# EAGLE design usb_ir (EAGLE 7.7.0)
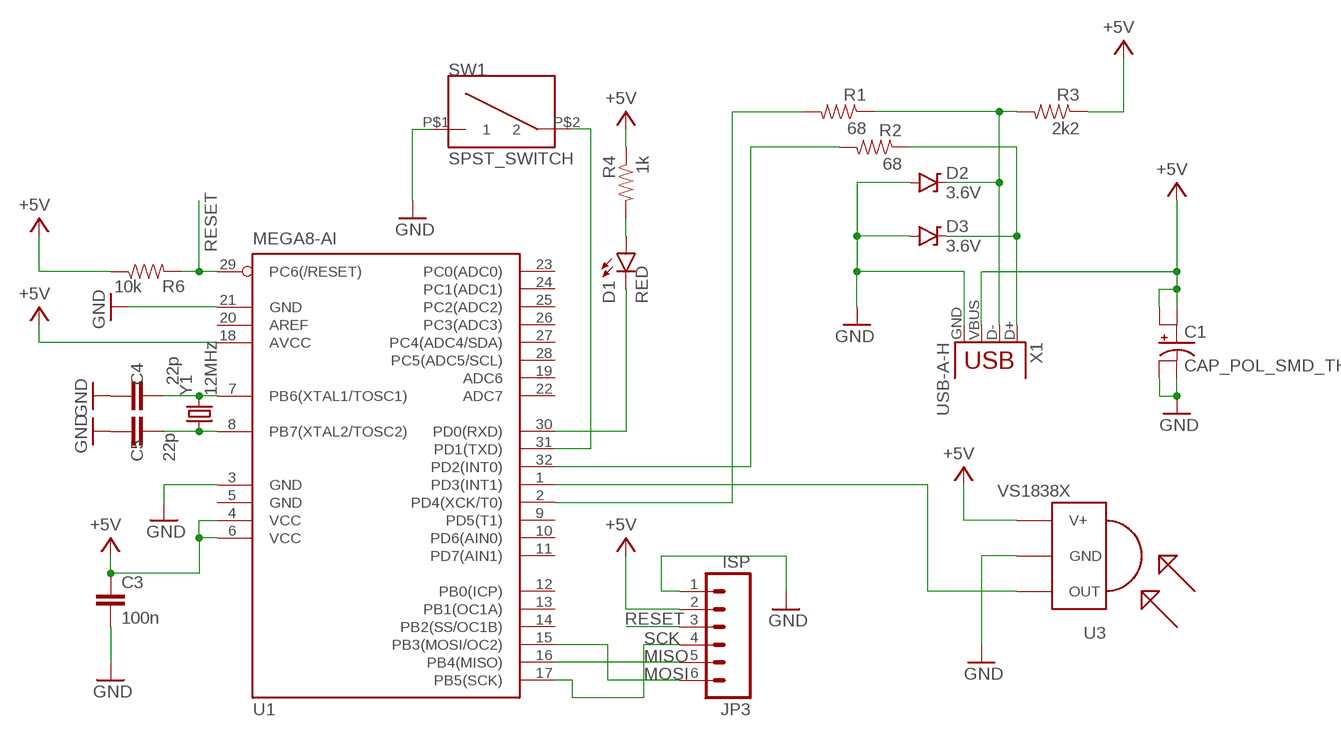
[diagram p0: schematic, sheet 1]

## Parts
C1  CAP_POL_SMD_TH  [CAP_SMD_TH_5X5]
C3  100n  CAP1206  [1206]
C4  22p  CAP1206  [1206]
C5  22p  CAP1206  [1206]
D1  RED  LED1206  [LED-1206]
D2  3.6V  DIODE-ZENERPTH  [DIODE-ZENER]
D3  3.6V  DIODE-ZENERPTH  [DIODE-ZENER]
JP3  ISP  M061X06-SMD_EDGE_FEMALE  [1X06-SMD_EDGE]
R1  68  RESISTOR1206  [1206]
R2  68  RESISTOR1206  [1206]
R3  2k2  RESISTOR1206  [1206]
R4  1k  RESISTOR1206  [1206]
R6  10k  RESISTOR1206  [1206]
SW1  SPST_SWITCH  [SMD_TACT_SWITCH]
U1  MEGA8-AI  [TQFP32-08]
U3  VS1838X  [VS1838X]
X1  USB-A-H  [USB-A-H]
Y1  12MHz  CRYSTALSMD  [HC49UP]

## Nets
+5V: C1.+ C1.+TH(+) C3.1 JP3.2 R3.1 R4.1 R6.1 U1.4(VCC) U1.6(VCC) U1.18(AVCC) U3.VCC(V+) X1.VBUS
GND: C1.- C1.-TH(-) C3.2 C4.1 C5.1 D2.P$2(A) D3.P$2(A) JP3.1 SW1.P$1 U1.3(GND) U1.21(GND) U3.GND X1.GND
MISO: JP3.5 U1.16(PB4(MISO))
MOSI: JP3.6 U1.15(PB3(MOSI/OC2))
N$1: U1.1(PD3(INT1)) U3.OUT
N$5: D2.P$1(C) R1.1 R3.2 X1.D-
N$6: D3.P$1(C) R2.1 X1.D+
N$7: R2.2 U1.32(PD2(INT0))
N$8: R1.2 U1.2(PD4(XCK/T0))
N$9: D1.C U1.30(PD0(RXD))
N$11: SW1.P$2 U1.31(PD1(TXD))
N$13: D1.A R4.2
N$22: C4.2 U1.7(PB6(XTAL1/TOSC1)) Y1.2
N$23: C5.2 U1.8(PB7(XTAL2/TOSC2)) Y1.1
RESET: JP3.3 R6.2 U1.29(PC6(/RESET))
SCK: JP3.4 U1.17(PB5(SCK))
Unconnected: U1.9(PD5(T1)) U1.10(PD6(AIN0)) U1.11(PD7(AIN1)) U1.12(PB0(ICP)) U1.13(PB1(OC1A)) U1.14(PB2(SS/OC1B)) U1.19(ADC6) U1.20(AREF) U1.22(ADC7) U1.23(PC0(ADC0)) U1.24(PC1(ADC1)) U1.25(PC2(ADC2)) U1.26(PC3(ADC3)) U1.27(PC4(ADC4/SDA)) U1.28(PC5(ADC5/SCL))

## Power pins joined to a net without a drawn wire
GND: U1.5(GND)

## Library data of the parts
C1 = Capacitors:CAP_POL_SMD_TH
C3-C5 = SparkFun-Capacitors:CAP: Capacitor Standard 0603 ceramic capacitor, and 0.1" leaded capacitor.
D1 = SparkFun-LED:LED: LEDs Standard schematic elements and footprints for 5mm, 3mm, 1206, and 0603 sized LEDs. 5mm - Spark Fun Electronics SKU : COM-00529 (and others)
D2 D3 = SparkFun-DiscreteSemi:DIODE-ZENER: Zener Diode Production Part - 8199 3.4V Zener Voltage
JP3 = SparkFun-Connectors:M06: Header 6 Standard 6-pin 0.1" header. Use with straight break away headers (SKU : PRT-00116), right angle break away headers (PRT-00553), swiss pins (PRT-00743), machine pins (PRT-00117), and female headers (PRT-00115). Molex polarized connector foot print use with SKU : PRT-08094 with associated crimp pins and housings. NOTES ON THE VARIANTS LOCK and LOCK_LONGPADS... This footprint was designed to help hold the alignment of a through-hole component (i.e. 6-pin header) while soldering it into place. You may notice that each hole has been shifted either up or down by 0.005 of an inch from it's more standard position (which is a perfectly straight line). This slight alteration caused the pins (the squares in the middle) to touch the edges of the holes. Because they are alternating, it causes a "brace" to hold the component in place. 0.005 has proven to be the perfect amount of "off-center" position when using our standard breakaway headers. Although looks a little odd when you look at the bare footprint, once you have a header in there, the alteration is very hard to notice. Also,if you push a header all the way into place, it is covered up entirely on the bottom side. This idea of altering the position of holes to aid alignment will be further integrated into the Sparkfun Library for other footprints. It can help hold any component with 3 or more connection pins.
R1-R4 R6 = SparkFun-Resistors:RESISTOR: Resistor Basic schematic elements and footprints for 0603, 1206, and PTH resistors.
SW1 = Switches:SPST_SWITCH
U1 = atmel:MEGA8: MICROCONTROLLER 8 Kbytes FLASH, 1 kbytes SRAM, 512 bytes EEPROM, USART, 6-channel 10 bit ADC, 2-channel 8 bit ADC Pin compatible with Atmega48, ATMega88, ATMega168 Source: avr.lbr; MPN: ATMEGA8-16AU; OC_FARNELL: 9171371; OC_NEWARK: 73M8863
U3 = tsop:VS1838X: VS1838 IR demodulator with supply rangeof 2.7V to 5V
X1 = SparkFun-Connectors:USB: USB Connectors USB-B-PTH is fully proven SKU : PRT-00139/CONN-08278 USB-miniB is fully proven SKU : PRT-00587 USB-A-PCB is untested. USB-A-H is throughly reviewed, but untested. Spark Fun Electronics SKU : PRT-00437 USB-B-SMT is throughly reviewed, but untested. Needs silkscreen touching up. USB-A-S has not been used/tested USB-MB-H has not been used/tested USB-MICROB has been used. CONN-09505; PROD_ID: CONN-08367
Y1 = SparkFun-FreqCtrl:CRYSTAL: Various standard crystals. Proven footprints.

## Board
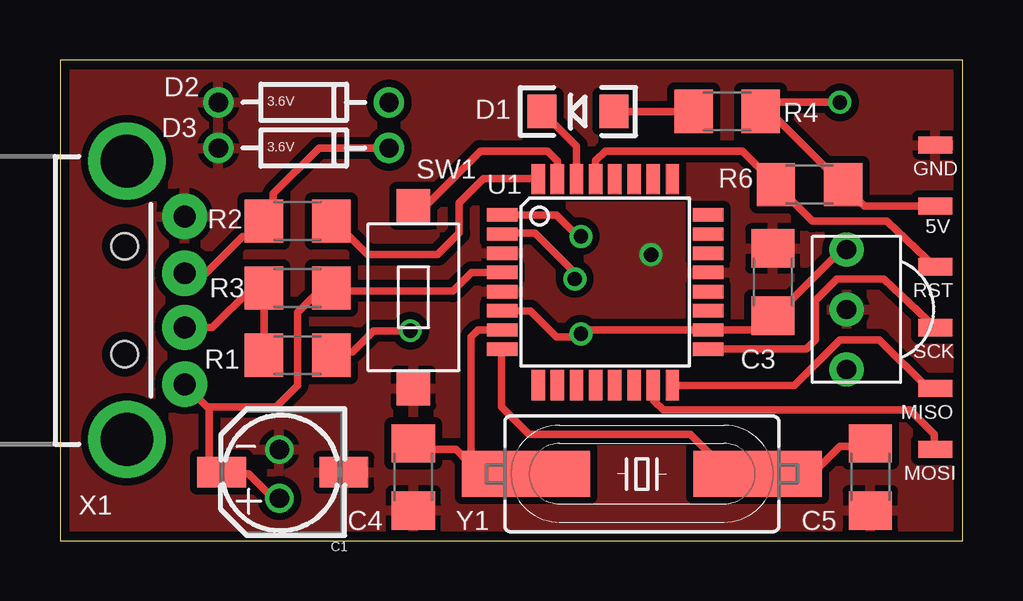
[diagram p1: board, top side]
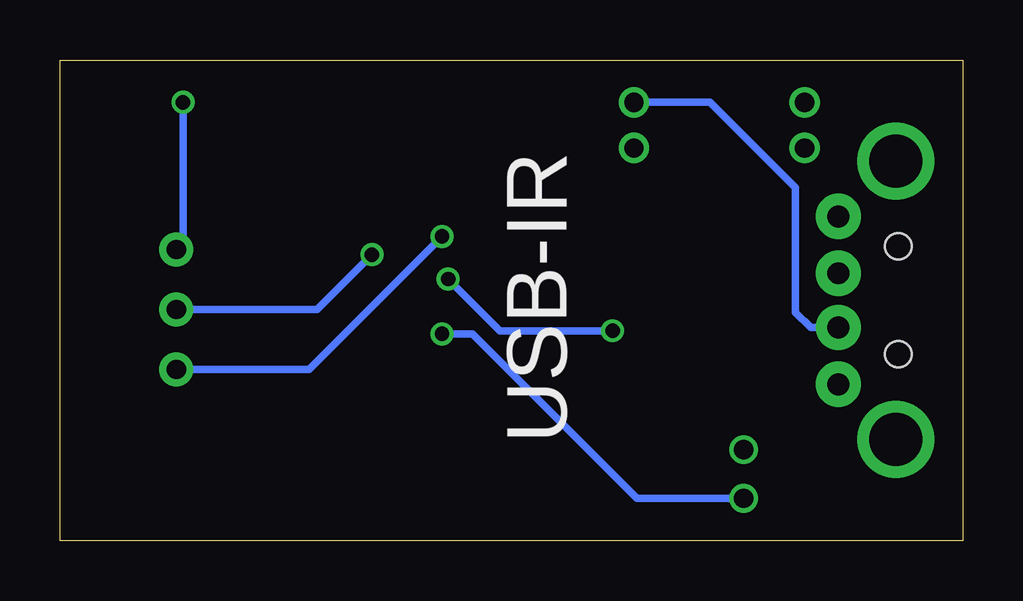
[diagram p2: board, bottom side, seen from below]

Size 37.64 x 20.06 mm. Coordinates in mm from the lower left corner, seen from the top.
Outline: 0,0 37.64,0 37.64,20.06 0,20.06 0,0
Copper layers (1*16): Top 0.0356mm / dielectric 1.5011mm / Bottom 0.0356mm
Design rules "LaenPCBOrder *": minimum track width 6mil, minimum drill 13mil, track to track 6mil, track to pad 6mil, pad to pad 6mil, via to via 6mil, smd to smd 6mil, copper to edge 15mil, drill to drill 6mil, minimum pad ring 7mil, minimum via ring 7mil, stop-mask expansion 3mil, vias tented up to drill 0mil, thermal gap 10mil

### Footprints (pad centres in the part's own frame; a part is rotated, then mirrored left to right if it is on the bottom)
CAP_SMD_TH_5X5 = smd 2.032 x 1.27: + 2.662,-0.2; - -2.435,-0.2 | drill 0.8: +TH 0.254,0.889; -TH 0.254,-1.143
1206 = smd 1.6 x 1.8: 1 -1.4,0; 2 1.4,0
LED-1206 = smd 1.2 x 1.4: A -1.5,0; C 1.5,0
DIODE-ZENER = drill 0.8 pad 1.27: P$1 -3.556,0; P$2 3.556,0
1X06-SMD_EDGE = smd 0.711 x 1.422: 1 0,-0.08; 2 2.54,-0.08; 3 5.08,-0.08; 4 7.62,-0.08; 5 10.16,-0.08; 6 12.7,-0.08
SMD_TACT_SWITCH = smd 1.397 x 1.397: P$1 -3.81,0; P$2 3.81,0
TQFP32-08 = smd 1.27 x 0.559: 1 -4.293,2.8; 2 -4.293,2; 3 -4.293,1.2; 4 -4.293,0.4; 5 -4.293,-0.4; 6 -4.293,-1.2; 7 -4.293,-2; 8 -4.293,-2.8; 17 4.293,-2.8; 18 4.293,-2; 19 4.293,-1.2; 20 4.293,-0.4; 21 4.293,0.4; 22 4.293,1.2; 23 4.293,2; 24 4.293,2.8 | smd 0.559 x 1.27: 9 -2.8,-4.293; 10 -2,-4.293; 11 -1.2,-4.293; 12 -0.4,-4.293; 13 0.4,-4.293; 14 1.2,-4.293; 15 2,-4.293; 16 2.8,-4.293; 25 2.8,4.293; 26 2,4.293; 27 1.2,4.293; 28 0.4,4.293; 29 -0.4,4.293; 30 -1.2,4.293; 31 -2,4.293; 32 -2.8,4.293
VS1838X = drill 0.8 pad 1.422: GND -0.001,0.481; OUT -2.501,0.481; VCC 2.499,0.481
USB-A-H = drill 0.914 pad 1.88: D+ 2.4,1.127; D- 2.4,-1.127; GND 2.4,3.5; VBUS 2.4,-3.5 | drill 2.2: GND2 0,-5.8; GND3 0,5.8 | hole 1.1: -0.1,2.25; -0.1,-2.25
HC49UP = smd 5.334 x 1.93: 1 -4.826,0; 2 4.826,0

### Placement (x,y rotation side)
C1  9.4,2.67 180 top
C3  29.72,10.79 90 top
C4  14.73,2.67 90 top
C5  33.78,2.67 90 top
D1  21.59,17.91 180 top
D2  10.16,18.29 180 top
D3  10.16,16.38 180 top
JP3  36.58,16.51 270 top
R1  9.91,7.75 0 top
R2  9.91,13.34 0 top
R3  9.91,10.54 180 top
R4  27.81,17.91 180 top
R6  31.24,14.86 180 top
SW1  14.73,10.16 90 top
U1  22.73,10.79 0 top
U3  33.27,9.65 90 top
X1  2.79,10.03 0 top
Y1  24.26,2.79 180 top

### Tracks (layer width: path | path; a pad name or v marks a point on that pad's centre or on a via)
+5V  (via drill 0.6)
  Top 0.305: R3.1 10.92,10.54 9.91,9.53 9.91,6.48 9.02,5.59 6.14,5.59 X1.VBUS 6.23,5.5 6.23,3.38 C1.+ 6.81,2.79 7.87,2.79 8.89,1.78 C1.+TH | R3.1 11.43,10.42 11.69,10.42 | R6.1 32.64,15.24 | 32.16,14.76 32.64,15.24 | U1.4 17.16,11.2 16.38,10.41 11.43,10.41 R3.1 | 32.64,15.24 | R6.1 29.59,17.91 R4.1 29.59,18.29 v32.51,18.29 | U1.6 19.61,9.6 20.7,8.51 21.59,8.51 v21.72,8.64 21.88,8.79 U1.18 29.12,8.79 C3.1 29.97,9.39 29.97,9.53 32.51,12.06 32.71,12.06 U3.VCC | JP3.2 33.53,13.97 R6.1
  Bottom 0.305: v21.72,8.64 20.45,8.64 13.59,1.78 C1.+TH | v32.51,18.29 32.51,12.43 U3.VCC
GND  (via drill 0.6)
  Bottom 0.305: v24.64,11.94 26.93,9.65 U3.GND
  pour Top (isolate 0.305): 0,20.19 0,0 37.59,0 37.59,20.32
MISO
  Top 0.305: U1.16 25.56,6.48 30.61,6.48 32.51,8.38 34.16,8.38 36.2,6.35 JP3.5
MOSI
  Top 0.305: U1.15 24.77,6.47 24.77,5.84 25.15,5.46 35.43,5.46 36.45,4.45 36.45,3.86 JP3.6
N$1  (via drill 0.6)
  Top 0.305: v21.72,12.7 21.59,12.7 20.7,13.59 U1.1
  Bottom 0.305: U3.OUT 27.27,7.15 v21.72,12.7
N$5
  Top 0.305: R1.1 R3.2 8,10.54 6.35,8.89 5.21,8.89 X1.D-
  Bottom 0.305: X1.D- 5.21,8.89 6.35,8.89 6.99,9.53 6.99,14.73 10.54,18.29 D2.P$1
N$6
  Top 0.305: X1.D+ 5.21,11.18 6.1,11.18 7.62,12.7 8.25,12.7 R2.1 8.89,13.72 8.89,14.47 10.79,16.38 D3.P$1
N$7
  Top 0.305: 19.78,15.24 U1.32 19.91,15.11 17.65,15.11 16.64,14.1 16.64,12.83 15.75,11.94 12.83,11.94 11.43,13.34 R2.2
N$8  (via drill 0.6)
  Top 0.305: U1.2 18.47,12.83 19.81,12.83 21.46,11.18 v21.46,10.92 | v14.61,8.76 13.08,8.76 12.19,7.87 11.43,7.87 R1.2
  Bottom 0.305: v14.61,8.76 19.3,8.76 v21.46,10.92
N$9
  Top 0.305: U1.30 21.53,16.46 D1.C
N$11
  Top 0.305: U1.31 20.73,15.84 20.32,16.26 17.53,16.26 15.37,14.1 SW1.P$2
N$13
  Top 0.305: D1.A R4.2
N$22
  Top 0.305: U1.7 17.43,8.79 17.14,8.51 17.14,3.3 | Y1.2 17.91,2.54 17.14,3.3 | 17.14,3.3 17.02,3.3 16.51,3.81 14.86,3.81 C4.2
N$23
  Top 0.305: Y1.1 27.81,2.92 26.29,4.45 19.56,4.45 18.41,5.59 18.41,7.97 U1.8 | 29.34,2.54 28.07,2.54 Y1.1 | Y1.1 31.37,2.79 32.51,3.94 33.78,3.94 C5.2
RESET
  Top 0.305: U1.29 22.33,15.86 22.73,16.26 28.45,16.26 R6.2 31.37,13.34 34.46,13.34 JP3.3
SCK
  Top 0.305: U1.17 31.11,8 31.5,8.38 31.5,10.03 32.38,10.92 34.34,10.92 JP3.4

### Text on the board
tNames: SW1 | GND | 5V | RST | SCK | MISO | MOSI
bNames: USB-IR